# Altium project PCB_Project1.PrjPcb
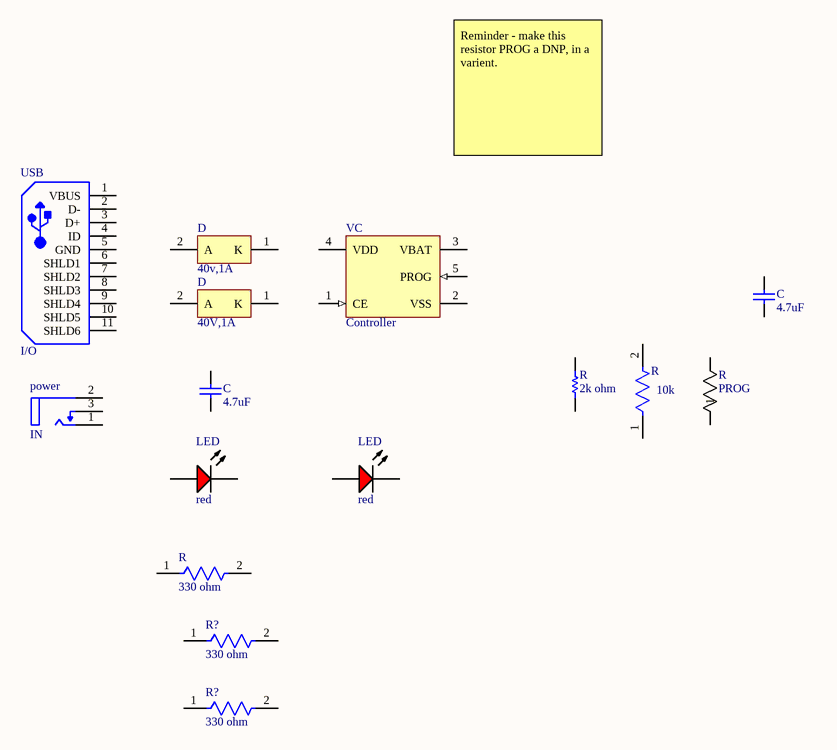
[diagram p0: Sheet1.SchDoc]
1 sheet, 15 parts. Net scope: global (net labels, ports and power ports of the same name join across sheets).
Board file: PCB1.PcbDoc

## Sheet Sheet1.SchDoc
size A; SheetNumber: 1; SheetTotal: 1

### Parts
(Parts that share a designator on the sheet are numbered #1, #2 ... from top to bottom, then left to right.)
C#1  4.7uF  [CAPC1608X90X35ML10T15]
C#2  4.7uF  [CAPC1608X90X35ML10T15]
D#1  40v,1A  [ONSC-SMA-2-403D-02_V]
D#2  40V,1A  [ONSC-SMA-2-403D-02_V]
LED#1  red  [VISH-TLMX1100_V]
LED#2  red  [VISH-TLMX1100_V]
power  IN  [FP-RASM722PTR13X-MFG]
R#1  2k ohm  [RESC2013X70X40LL20T20]
R#2  PROG  [RES_AC05_VIS]
R#3  10k  [FP-CRGH0805-IPC_C]
R#4  330 ohm  [FP-CR0805-IPC_B]
R?#1  330 ohm  [FP-CR0805-IPC_B]
R?#2  330 ohm  [FP-CR0805-IPC_B]
USB  I/O  [USB-MICRO-B_V]
VC  Controller  [SOT-23-OT5_M]

### Nets

Not connected (* = marked no-connect by the designer): C#1 1 2; C#2 1 2; D#1 1(K) 2(A); D#2 1(K) 2(A); LED#1 1(A) 2(K); LED#2 1(A) 2(K); power 1(TIP_TERMINAL(CENTER_PIN)) 2(SLEEVE_TERMINAL) 3(SHUNT_TERMINAL); R#1 1 2; R#2 1 2; R#3 1 2; R#4 1 2; R?#1 1 2; R?#2 1 2; USB 1(VBUS) 2(D-) 3(D+) 4(ID) 5(GND) 6(SHLD1) 7(SHLD2) 8(SHLD3) 9(SHLD4) 10(SHLD5) 11(SHLD6); VC 1(CE) 2(VSS) 3(VBAT) 4(VDD) 5(PROG)

### Notes on the sheet
- Reminder - make this resistor PROG a DNP, in a varient.

### Library data of the parts
C#1 C#2 = CMP-2006-02503-1: Manufacturer: Murata; Part Number: GRM188R60J475KE19J
D#1 D#2 = CMP-1055-00320-1: Schottky Power Rectifier, 2-Pin SMA, Pb-Free, Tape and Reel; PartNumber: MBRA140T3G; Manufacturer: On Semiconductor; Configuration: Single; IFSM Max (A): 30; PackageReference: SMA-2-403D-02; PackageDescription: 2-Pin Small Molded Package, J-Bend Lead, Body 2.605 x 4.315 mm; RoHS: TRUE; ComponentLink1Description: Manufacturer URL; Packing: Tape and Reel; ComponentLink3URL: http://www.onsemi.com/pub_link/Collateral/403D-02.PDF; ComponentLink2Description: Datasheet; ComponentLink2URL: http://www.onsemi.cn/pub_link/Collateral/MBRA140T3-D.PDF; DatasheetVersion: Rev. 10; ComponentLink1URL: http://www.onsemi.com/; ComponentLink3Description: Package Specification; Mounting Technology: Surface Mount; PackageVersion: Rev. G, 07/2012
LED#1 LED#2 = CMP-1666-00027-1: LED, RED, 2.1 V, -40 to 100 degC, 2-Pin SMD (0603), RoHS, Tape and Reel; Type (Capacitors): C0G; Resistance: 100000000000 Ohm; Capacitance: 12 pF; Voltage Rating: 50 V; Tolerance: 5%; Min Operating Temperature: -55degC; REACH SVHC: No SVHC; ComponentLink2Description: Datasheet; ComponentLink1URL: http://www.vishay.com/; Width: 0.8 mm; Package Quantity: 4000; PackageReference: TLMX1100; ComponentLink2URL: http://www.vishay.com/docs/83173/tlmb1100.pdf; Case/Package: 0603; Case Code (Metric): 1608; Packaging: Tape and Reel; Pins: 2; ComponentLink1Description: Manufacturer URL; Max Operating Temperature: 125degC; Height: 0.8 mm; Length: 1.6 mm; Mount: Surface Mount; PackageDescription: 2-Pin Surface Mount Device, Body 1.6 x 0.8 mm; DatasheetVersion: Rev. 2.7, 03/2016; Case Code (Imperial): 0603; Voltage Rating (DC): 50 V; RoHSCompliant: True; Radiation Hardening: No
power = CMP-47995-000002-1: CONN PWR JACK 2.1X5.5MM SOLDER; Shielding: Unshielded; Gender: Male; Current Rating: 5A; Termination: Solder; Contact Material: Copper Alloy; Package Quantity: 120; Case/Package: SMD/SMT; Contact Plating: Tin; Connector Type: Jack; Housing Material: Thermoplastic; Mount: Surface Mount; Housing Color: Black; Color: Black
R#1 = CMP-2001-00483-1: Part Number: ERJ-P06J202V; Manufacturer: Panasonic
R#2 = CMP-00030-42521956-1: AC05000004707JAC00 Resistor, 470 Milliohms, ± 5%, 5 W, Axial Leaded, Wirewound, General Purpose; Lead Diameter: 800µm; Temperature Coefficient: 600ppm/°C; Power Rating: 5W; Voltage Rating (DC): 1.5V; Resistance: 470mΩ; Number of Terminations: 2; Case/Package: Axial; Military Standard: Not; Width: 7.49mm; REACH SVHC: Unknown; Radiation Hardening: No; Length: 18mm; Features: Flame Retardant Coating; Contact Plating: Tin; Tolerance: 5%; Voltage Rating: 1.5V; Lead Free: Lead Free; Schedule B: 8533210080, 8533210080; Max Operating Temperature: 275°C; Number of Pins: 2; Diameter: 7.5mm; Packaging: Cut Tape (CT); NexarPartId: 42521956; Min Operating Temperature: -40°C; Composition: Wirewound; RoHS: Compliant; Termination: Axial; Max Power Dissipation: 5W
R#3 = CMP-03211-003215-1: RES SMD 10K OHM 1% 1/3W 0805; Manufacturer: TE Connectivity; Manufacturer Part Number: CRGH0805F10K; Power Rating: 0.33W; Description: 10 kOhms ±1% 0.333W, 1/3W Chip Resistor 0805 (2012 Metric)  Thick Film; Value: 10kΩ; Voltage Rating: 150V; Temperature Coefficient: 100ppm/°C; ComponentLink2URL: https://www.te.com/commerce/DocumentDelivery/DDEController?Action=srchrtrv&DocNm=1773204-1&DocType=DS&DocLang=English; Device Class L1: Passive Components; Tolerance: 1%; Ipc Land Pattern Name: RESC200125X55; Digikey Description: RES SMD 10K OHM 1% 1/3W 0805; ComponentLink2Description: Datasheet; Lead Free: Yes; Octopart: https://octopart.com/crgh0805f10k-te+connectivity-24383672; Series: CRGH; Category: Res; RoHS: TRUE; Resistance: 10kΩ; Device Class L3: Chip SMD Resistors; Temperature Range Low: -55°C; Temperature Range High: +155°C; Height: 0.65mm; Package: CRGH0805; Device Class L2: Resistors; Composition: Thick Film; Temperature: -55°C to +155°C; Automotive: No
R#4 R?#1 R?#2 = CMP-1013-00454-2: Thick Film Chip Resistors 0805 330Ω 0.125W 1% 100ppm/°C; Voltage Rating: 150V; Resistance: 330R; Power Rating: 125mW; Case Code (Imperial): 0805; Packaging: Tape and Reel; REACH SVHC: No SVHC; Min Operating Temperature: -55°C; Height: 0.5mm; Tolerance: 1%; Radiation Hardening: No; Depth: 1.25mm; Mount: Surface Mount; Length: 2mm; Voltage Rating (DC): 150V; Contact Plating: Tin; Temperature Coefficient: 100ppm/°C; Thickness: 508um; Max Operating Temperature: 155°C; Termination: SMD/SMT; Military Standard: Not; Case Code (Metric): 2012; Width: 1.25mm; Package Quantity: 5000; Case/Package: 0805; Composition: Thick Film
USB = CMP-2000-05827-1: Micro-USB B Receptacle, Right Angle, Bottom Mount, Surface Mount, with Solder Tabs, -30 to 85 degC, 5-Pin USB, RoHS, Tape and Reel; Manufacturer: Molex; Featured Product: Micro-USBConnectorsUSBConnectors; Other Names: WM1399DKR; Package Version: Rev. F, 12/2012; Number of Contacts: 5; Connector Type: USB-microB; Catalog Drawings: 1050170001; 3D Model: 105017-0001.stp; Mating Products: WM17145-ND-CABLEMICROUSBBTOSTDA1.0MWM17147-ND-CABLEMICROUSBBTOSTDA2.0MWM17146-ND-CABLEMICROUSBBTOSTDA1.5M; PCN Assembly/Origin: ResinSupplier21/Oct/2015; Voltage - Max: 30V; Online Catalog: Molex-MicroUSB; Manufacturer URL: http://www.molex.com/; Package Description: 5-Leads USB, Micro B, Body 7.5 x 5 mm, Pitch 0.65 mm; Datasheet URL: http://www.molex.com/elqNow/elqRedir.htm?ref=http://www.molex.com/webdocs/datasheets/pdf/en-us/1050170001_IO_CONNECTORS.pdf; Ingress Protection: -; Datasheet Version: 03/2016; Mounting Type: BoardCutout,SurfaceMount,RightAngle; Circuits: 5; Standard Package: 1; Package Reference: MICRO-B; Package URL: http://www.molex.com/pdm_docs/sd/1050170001_sd.pdf; Category: Connectors,Interconnects; Series: -; RoHS Information: 1050170001CertofCompliance; Features: Shielded,SolderRetention; Family: USB,DVI,HDMIConnectors; Specifications: -; Gender: Receptacle; Packaging: Digi-Reel®; Mounting Technology: SurfaceMount
VC = CMP-0133-00141-1: Simple, Miniature Single-Cell, Fully Integrated Li-Ion/Li-Polymer Charge Management Controller, 4.2V, 5-Pin SOT-23, Industrial Temperature, Tape and Reel; PackageReference: SOT-23-OT5; PackageVersion: revBB, Aug-2009; PackageDescription: 5-Lead Plastic Small Outline Transistor (OT) [SOT-23]; Code_IPC: SOT23-5; DatasheetVersion: revB, Sep-2007